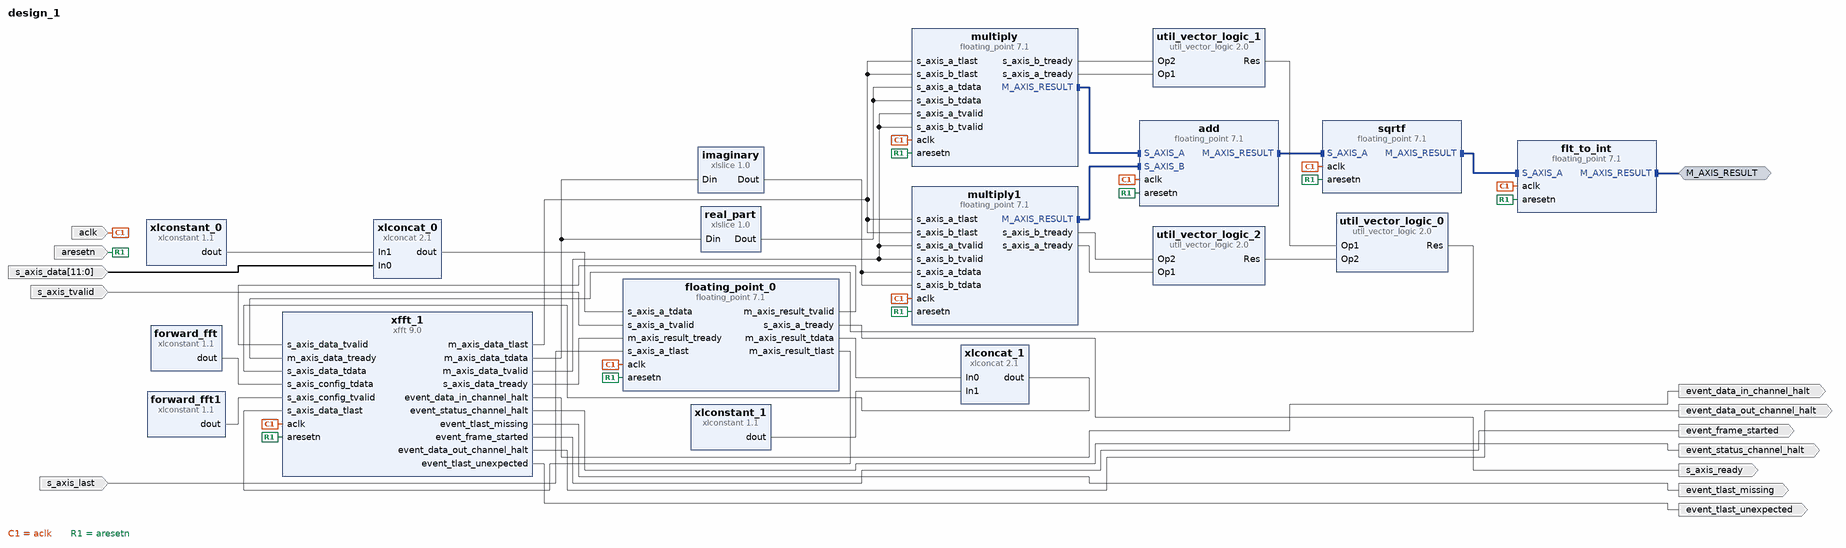
[diagram p0: block diagram of the top level]
# Vivado block design design_1, xc7a100tcsg324-1, Vivado 2017.2
create_bd_design design_1

create_bd_intf_port -mode Master -vlnv xilinx.com:interface:axis_rtl:1.0 M_AXIS_RESULT
create_bd_port -dir I -type clk aclk
create_bd_port -dir O s_axis_ready
create_bd_port -dir I s_axis_tvalid
create_bd_port -dir I -from 11 -to 0 -type data s_axis_data
create_bd_port -dir O -type intr event_data_in_channel_halt
create_bd_port -dir O -type intr event_status_channel_halt
create_bd_port -dir O -type intr event_tlast_missing
create_bd_port -dir O -type intr event_frame_started
create_bd_port -dir O -type intr event_data_out_channel_halt
create_bd_port -dir O -type intr event_tlast_unexpected
create_bd_port -dir I s_axis_last
create_bd_port -dir I -type rst aresetn

create_bd_cell -type ip -vlnv xilinx.com:ip:xfft:9.0 xfft_1
set_property -dict [list \
  CONFIG.transform_length 1024 \
  CONFIG.target_clock_frequency 100 \
  CONFIG.implementation_options automatically_select \
  CONFIG.run_time_configurable_transform_length false \
  CONFIG.data_format floating_point \
  CONFIG.phase_factor_width 24 \
  CONFIG.scaling_options scaled \
  CONFIG.rounding_modes truncation \
  CONFIG.aresetn true \
  CONFIG.ovflo false \
  CONFIG.throttle_scheme nonrealtime \
  CONFIG.output_ordering natural_order \
  CONFIG.memory_options_phase_factors block_ram \
  CONFIG.number_of_stages_using_block_ram_for_data_and_phase_factors 3 \
  CONFIG.complex_mult_type use_mults_performance \
] [get_bd_cells xfft_1]
create_bd_cell -type ip -vlnv xilinx.com:ip:xlconstant:1.1 forward_fft
set_property -dict {CONFIG.CONST_WIDTH 16 CONFIG.CONST_VAL 0x0001} [get_bd_cells forward_fft]
create_bd_cell -type ip -vlnv xilinx.com:ip:xlslice:1.0 imaginary
set_property -dict {CONFIG.DIN_TO 32 CONFIG.DIN_FROM 63 CONFIG.DIN_WIDTH 64 CONFIG.DOUT_WIDTH 32} [get_bd_cells imaginary]
create_bd_cell -type ip -vlnv xilinx.com:ip:xlslice:1.0 real_part
set_property -dict {CONFIG.DIN_TO 0 CONFIG.DIN_FROM 31 CONFIG.DIN_WIDTH 64 CONFIG.DOUT_WIDTH 32} [get_bd_cells real_part]
create_bd_cell -type ip -vlnv xilinx.com:ip:floating_point:7.1 multiply
set_property -dict [list \
  CONFIG.Operation_Type Multiply \
  CONFIG.Add_Sub_Value Both \
  CONFIG.Result_Precision_Type Single \
  CONFIG.C_Result_Exponent_Width 8 \
  CONFIG.C_Result_Fraction_Width 24 \
  CONFIG.C_Mult_Usage Medium_Usage \
  CONFIG.Maximum_Latency true \
  CONFIG.C_Latency 9 \
  CONFIG.C_Rate 1 \
  CONFIG.Has_ARESETn true \
  CONFIG.Has_A_TLAST true \
  CONFIG.Has_B_TLAST true \
  CONFIG.RESULT_TLAST_Behv AND_all_TLASTs \
] [get_bd_cells multiply]
create_bd_cell -type ip -vlnv xilinx.com:ip:floating_point:7.1 multiply1
set_property -dict [list \
  CONFIG.Operation_Type Multiply \
  CONFIG.Add_Sub_Value Both \
  CONFIG.Result_Precision_Type Single \
  CONFIG.C_Result_Exponent_Width 8 \
  CONFIG.C_Result_Fraction_Width 24 \
  CONFIG.C_Mult_Usage Medium_Usage \
  CONFIG.C_Latency 9 \
  CONFIG.C_Rate 1 \
  CONFIG.Has_ARESETn true \
  CONFIG.C_Has_INVALID_OP true \
  CONFIG.Has_A_TLAST true \
  CONFIG.Has_B_TLAST true \
  CONFIG.RESULT_TLAST_Behv AND_all_TLASTs \
] [get_bd_cells multiply1]
create_bd_cell -type ip -vlnv xilinx.com:ip:floating_point:7.1 add
set_property -dict [list \
  CONFIG.Operation_Type Add_Subtract \
  CONFIG.Add_Sub_Value Add \
  CONFIG.Result_Precision_Type Single \
  CONFIG.C_Result_Exponent_Width 8 \
  CONFIG.C_Result_Fraction_Width 24 \
  CONFIG.C_Mult_Usage Full_Usage \
  CONFIG.C_Latency 12 \
  CONFIG.C_Rate 1 \
  CONFIG.Has_ARESETn true \
  CONFIG.Has_A_TLAST true \
  CONFIG.Has_B_TLAST true \
  CONFIG.RESULT_TLAST_Behv AND_all_TLASTs \
] [get_bd_cells add]
create_bd_cell -type ip -vlnv xilinx.com:ip:xlconstant:1.1 forward_fft1
set_property -dict {CONFIG.CONST_WIDTH 1 CONFIG.CONST_VAL 0x0001} [get_bd_cells forward_fft1]
create_bd_cell -type ip -vlnv xilinx.com:ip:xlconcat:2.1 xlconcat_0
create_bd_cell -type ip -vlnv xilinx.com:ip:floating_point:7.1 floating_point_0
set_property -dict [list \
  CONFIG.Operation_Type Fixed_to_float \
  CONFIG.A_Precision_Type Uint32 \
  CONFIG.C_A_Exponent_Width 32 \
  CONFIG.Result_Precision_Type Single \
  CONFIG.C_Result_Exponent_Width 8 \
  CONFIG.C_Result_Fraction_Width 24 \
  CONFIG.C_Accum_Msb 32 \
  CONFIG.C_Accum_Lsb -31 \
  CONFIG.C_Accum_Input_Msb 32 \
  CONFIG.C_Mult_Usage No_Usage \
  CONFIG.C_Latency 6 \
  CONFIG.C_Rate 1 \
  CONFIG.Has_ARESETn true \
  CONFIG.Has_A_TLAST true \
  CONFIG.RESULT_TLAST_Behv Pass_A_TLAST \
] [get_bd_cells floating_point_0]
create_bd_cell -type ip -vlnv xilinx.com:ip:xlconstant:1.1 xlconstant_0
set_property -dict {CONFIG.CONST_WIDTH 20 CONFIG.CONST_VAL 0} [get_bd_cells xlconstant_0]
create_bd_cell -type ip -vlnv xilinx.com:ip:floating_point:7.1 flt_to_int
set_property -dict [list \
  CONFIG.Operation_Type Float_to_fixed \
  CONFIG.Add_Sub_Value Both \
  CONFIG.Result_Precision_Type Custom \
  CONFIG.C_Result_Exponent_Width 32 \
  CONFIG.C_Result_Fraction_Width 0 \
  CONFIG.C_Mult_Usage No_Usage \
  CONFIG.C_Latency 7 \
  CONFIG.C_Rate 1 \
  CONFIG.Has_ARESETn true \
  CONFIG.C_Has_OVERFLOW true \
  CONFIG.Has_A_TLAST true \
  CONFIG.RESULT_TLAST_Behv Pass_A_TLAST \
] [get_bd_cells flt_to_int]
create_bd_cell -type ip -vlnv xilinx.com:ip:xlconcat:2.1 xlconcat_1
set_property -dict {CONFIG.IN0_WIDTH 32 CONFIG.IN1_WIDTH 32} [get_bd_cells xlconcat_1]
create_bd_cell -type ip -vlnv xilinx.com:ip:xlconstant:1.1 xlconstant_1
set_property -dict {CONFIG.CONST_WIDTH 32 CONFIG.CONST_VAL 0} [get_bd_cells xlconstant_1]
create_bd_cell -type ip -vlnv xilinx.com:ip:util_vector_logic:2.0 util_vector_logic_0
set_property -dict {CONFIG.C_SIZE 2} [get_bd_cells util_vector_logic_0]
create_bd_cell -type ip -vlnv xilinx.com:ip:util_vector_logic:2.0 util_vector_logic_1
set_property -dict {CONFIG.C_SIZE 2} [get_bd_cells util_vector_logic_1]
create_bd_cell -type ip -vlnv xilinx.com:ip:util_vector_logic:2.0 util_vector_logic_2
set_property -dict {CONFIG.C_SIZE 2} [get_bd_cells util_vector_logic_2]
create_bd_cell -type ip -vlnv xilinx.com:ip:floating_point:7.1 sqrtf
set_property -dict [list \
  CONFIG.Operation_Type Square_root \
  CONFIG.Result_Precision_Type Single \
  CONFIG.C_Result_Exponent_Width 8 \
  CONFIG.C_Result_Fraction_Width 24 \
  CONFIG.C_Mult_Usage No_Usage \
  CONFIG.C_Latency 29 \
  CONFIG.C_Rate 1 \
  CONFIG.Has_ARESETn true \
  CONFIG.Has_A_TLAST true \
  CONFIG.RESULT_TLAST_Behv Pass_A_TLAST \
] [get_bd_cells sqrtf]

# ---- connections ----

connect_bd_intf_net [get_bd_intf_pins multiply/M_AXIS_RESULT] [get_bd_intf_pins add/S_AXIS_A]
connect_bd_intf_net [get_bd_intf_pins multiply1/M_AXIS_RESULT] [get_bd_intf_pins add/S_AXIS_B]
connect_bd_intf_net [get_bd_intf_pins add/M_AXIS_RESULT] [get_bd_intf_pins sqrtf/S_AXIS_A]
connect_bd_intf_net [get_bd_intf_pins sqrtf/M_AXIS_RESULT] [get_bd_intf_pins flt_to_int/S_AXIS_A]
connect_bd_intf_net [get_bd_intf_ports M_AXIS_RESULT] [get_bd_intf_pins flt_to_int/M_AXIS_RESULT]
connect_bd_net [get_bd_pins forward_fft/dout] [get_bd_pins xfft_1/s_axis_config_tdata]
connect_bd_net [get_bd_pins xfft_1/m_axis_data_tdata] [get_bd_pins real_part/Din] [get_bd_pins imaginary/Din]
connect_bd_net [get_bd_pins xfft_1/m_axis_data_tlast] \
  [get_bd_pins multiply/s_axis_a_tlast] [get_bd_pins multiply/s_axis_b_tlast] [get_bd_pins multiply1/s_axis_a_tlast] \
  [get_bd_pins multiply1/s_axis_b_tlast]
connect_bd_net [get_bd_pins xfft_1/m_axis_data_tvalid] \
  [get_bd_pins multiply1/s_axis_b_tvalid] [get_bd_pins multiply1/s_axis_a_tvalid] [get_bd_pins multiply/s_axis_b_tvalid] \
  [get_bd_pins multiply/s_axis_a_tvalid]
connect_bd_net [get_bd_ports aclk] \
  [get_bd_pins xfft_1/aclk] [get_bd_pins multiply1/aclk] [get_bd_pins add/aclk] [get_bd_pins multiply/aclk] \
  [get_bd_pins floating_point_0/aclk] [get_bd_pins flt_to_int/aclk] [get_bd_pins sqrtf/aclk]
connect_bd_net [get_bd_pins imaginary/Dout] [get_bd_pins multiply1/s_axis_a_tdata] [get_bd_pins multiply1/s_axis_b_tdata]
connect_bd_net [get_bd_pins real_part/Dout] [get_bd_pins multiply/s_axis_a_tdata] [get_bd_pins multiply/s_axis_b_tdata]
connect_bd_net [get_bd_pins forward_fft1/dout] [get_bd_pins xfft_1/s_axis_config_tvalid]
connect_bd_net [get_bd_pins xlconcat_0/dout] [get_bd_pins floating_point_0/s_axis_a_tdata]
connect_bd_net [get_bd_pins floating_point_0/s_axis_a_tready] [get_bd_ports s_axis_ready]
connect_bd_net -net int_in_valid [get_bd_ports s_axis_tvalid] [get_bd_pins floating_point_0/s_axis_a_tvalid]
connect_bd_net [get_bd_pins xlconstant_1/dout] [get_bd_pins xlconcat_1/In1]
connect_bd_net [get_bd_pins floating_point_0/m_axis_result_tdata] [get_bd_pins xlconcat_1/In0]
connect_bd_net [get_bd_pins xfft_1/s_axis_data_tready] [get_bd_pins floating_point_0/m_axis_result_tready]
connect_bd_net [get_bd_pins floating_point_0/m_axis_result_tvalid] [get_bd_pins xfft_1/s_axis_data_tvalid]
connect_bd_net [get_bd_pins xlconcat_1/dout] [get_bd_pins xfft_1/s_axis_data_tdata]
connect_bd_net -net int_in_1 [get_bd_ports s_axis_data] [get_bd_pins xlconcat_0/In0]
connect_bd_net [get_bd_pins xlconstant_0/dout] [get_bd_pins xlconcat_0/In1]
connect_bd_net [get_bd_pins multiply/s_axis_b_tready] [get_bd_pins util_vector_logic_1/Op2]
connect_bd_net [get_bd_pins multiply/s_axis_a_tready] [get_bd_pins util_vector_logic_1/Op1]
connect_bd_net [get_bd_pins multiply1/s_axis_b_tready] [get_bd_pins util_vector_logic_2/Op2]
connect_bd_net [get_bd_pins multiply1/s_axis_a_tready] [get_bd_pins util_vector_logic_2/Op1]
connect_bd_net [get_bd_pins util_vector_logic_2/Res] [get_bd_pins util_vector_logic_0/Op2]
connect_bd_net [get_bd_pins util_vector_logic_1/Res] [get_bd_pins util_vector_logic_0/Op1]
connect_bd_net [get_bd_pins util_vector_logic_0/Res] [get_bd_pins xfft_1/m_axis_data_tready]
connect_bd_net [get_bd_pins xfft_1/event_data_in_channel_halt] [get_bd_ports event_data_in_channel_halt]
connect_bd_net [get_bd_pins xfft_1/event_status_channel_halt] [get_bd_ports event_status_channel_halt]
connect_bd_net [get_bd_pins xfft_1/event_tlast_missing] [get_bd_ports event_tlast_missing]
connect_bd_net [get_bd_pins xfft_1/event_frame_started] [get_bd_ports event_frame_started]
connect_bd_net [get_bd_pins xfft_1/event_data_out_channel_halt] [get_bd_ports event_data_out_channel_halt]
connect_bd_net [get_bd_pins xfft_1/event_tlast_unexpected] [get_bd_ports event_tlast_unexpected]
connect_bd_net [get_bd_ports s_axis_last] [get_bd_pins floating_point_0/s_axis_a_tlast]
connect_bd_net [get_bd_pins floating_point_0/m_axis_result_tlast] [get_bd_pins xfft_1/s_axis_data_tlast]
connect_bd_net [get_bd_ports aresetn] \
  [get_bd_pins multiply/aresetn] [get_bd_pins multiply1/aresetn] [get_bd_pins floating_point_0/aresetn] \
  [get_bd_pins sqrtf/aresetn] [get_bd_pins flt_to_int/aresetn] [get_bd_pins xfft_1/aresetn] [get_bd_pins add/aresetn]

validate_bd_design
save_bd_design
